# Altium schematic sheet [1]-Schematic block.SchDoc
size A4; DocumentNumber: 1; SheetNumber: 1; SheetTotal: 11
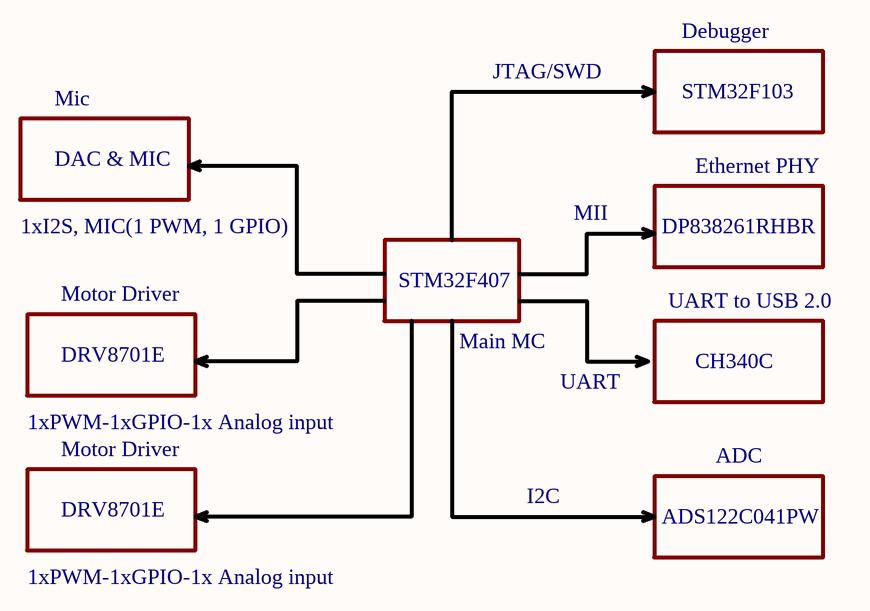
[diagram p0: [1]-Schematic block.SchDoc]

## Notes on the sheet
- JTAG/SWD
- Debugger
- Mic
- STM32F103
- DAC & MIC
- Ethernet PHY
- 1xI2S, MIC(1 PWM, 1 GPIO)
- MII
- DP838261RHBR
- Motor Driver
- STM32F407
- Main MC
- UART to USB 2.0
- DRV8701E
- UART
- CH340C
- 1xPWM-1xGPIO-1x Analog input
- ADC
- I2C
- ADS122C041PW